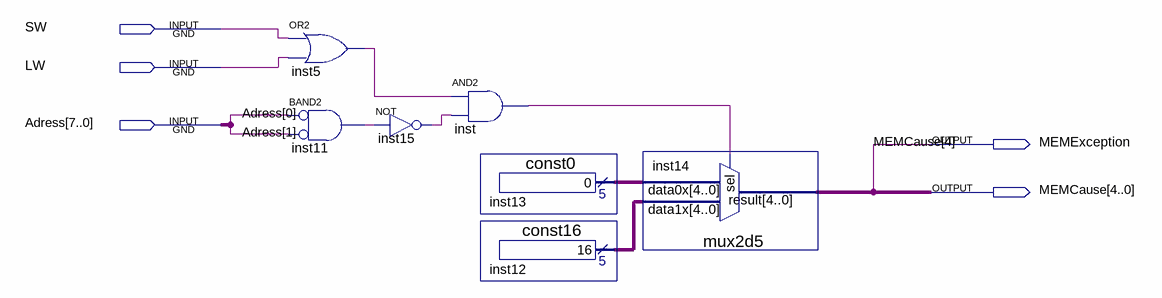
[diagram p0: schematic sheet]
// Quartus schematic OddDetector.bdf as structural Verilog: 7 symbols, 5 pins
module OddDetector (
  input  SW,
  input  LW,
  input  [7:0] Adress,
  output MEMException,
  output [4:0] MEMCause
);

  wire inst5_out, inst11_out, inst15_out, inst_out;
  wire [4:0] inst12_result, inst13_result;

  or inst5 (inst5_out, SW, LW);
  and inst11 (inst11_out, ~Adress[0], ~Adress[1]);  // BAND2
  not inst15 (inst15_out, inst11_out);
  and inst (inst_out, inst5_out, inst15_out);
  const0 inst13 (.result(inst13_result));
  const16 inst12 (.result(inst12_result));
  mux2d5 inst14 (.data1x(inst12_result), .data0x(inst13_result), .sel(inst_out), .result(MEMCause));

  assign MEMException = MEMCause[4];
endmodule
